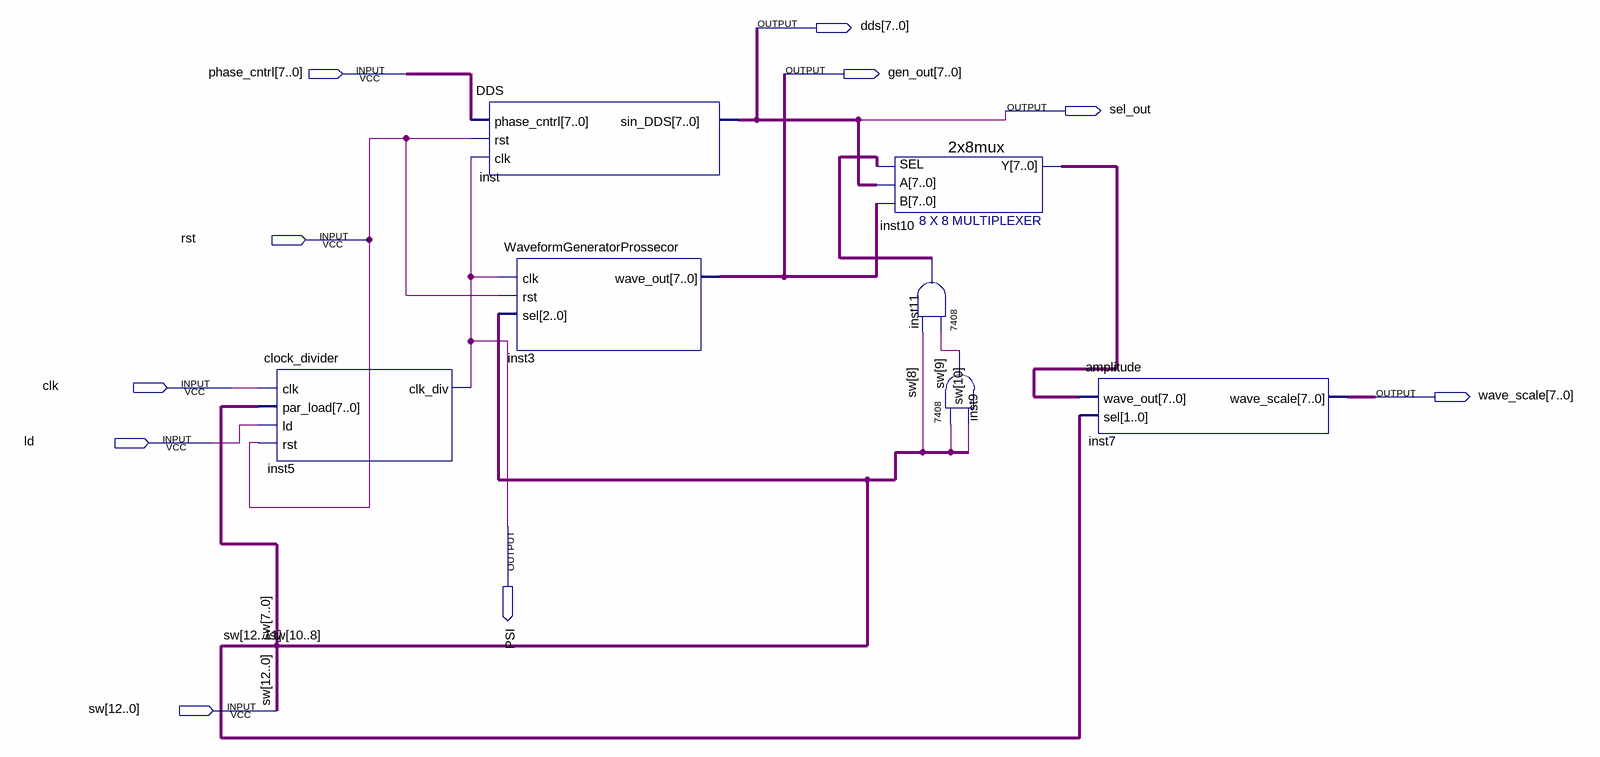
[diagram p0: schematic sheet]
// Quartus schematic FunctionGenerator.bdf as structural Verilog: 7 symbols, 10 pins
module FunctionGenerator (
  input  [7:0] phase_cntrl,
  input  rst,
  input  clk,
  input  ld,
  input  [12:0] sw,
  output [7:0] dds,
  output [7:0] gen_out,
  output sel_out,
  output [7:0] wave_scale,
  output PSI
);

  wire inst9_1, inst11_1;
  wire [7:0] inst10_y;

  clock_divider inst5 (.clk(clk), .par_load(sw[7:0]), .ld(ld), .rst(rst), .clk_div(PSI));
  DDS inst (.phase_cntrl(phase_cntrl), .rst(rst), .clk(PSI), .sin_DDS(dds));
  WaveformGeneratorProssecor inst3 (.clk(PSI), .rst(rst), .sel(sw[10:8]), .wave_out(gen_out));
  \2x8mux  inst10 (.SEL(inst11_1), .A(dds), .B(gen_out), .Y(inst10_y));
  \7408  inst11 (.\3 (sw[8]), .\2 (inst9_1), .\1 (inst11_1));
  \7408  inst9 (.\3 (sw[10]), .\2 (sw[9]), .\1 (inst9_1));
  amplitude inst7 (.wave_out(inst10_y), .sel(sw[12:11]), .wave_scale(wave_scale));
endmodule
